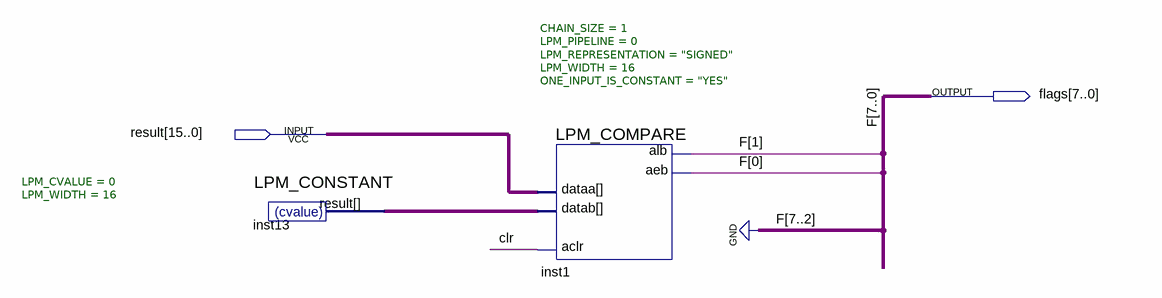
[diagram p0: schematic sheet]
// Quartus schematic arithmetic_flags.bdf as structural Verilog: 2 symbols, 2 pins
module arithmetic_flags (
  input  [15:0] result,
  output [7:0] flags
);

  wire clr;
  wire [15:0] inst13_result;

  LPM_CONSTANT #(.LPM_CVALUE(0), .LPM_WIDTH(16)) inst13 (.result(inst13_result));
  LPM_COMPARE #(.CHAIN_SIZE(1), .LPM_PIPELINE(0), .LPM_REPRESENTATION("SIGNED"), .LPM_WIDTH(16), .ONE_INPUT_IS_CONSTANT("YES")) inst1 (
    .dataa(result), .datab(inst13_result), .aclr(clr), .aeb(flags[0]), .alb(flags[1]));

  assign flags[7:2] = {6{1'b0}};

  // Other names for the same wires on the sheet: F[1:0] = flags[1:0]
endmodule
